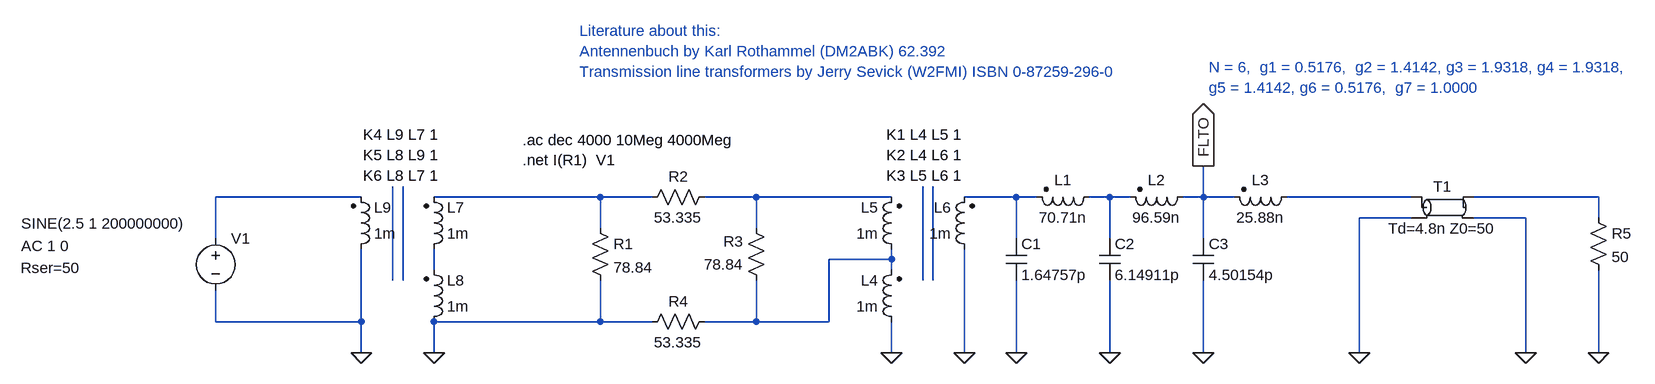
[diagram p0: schematic Circuit.asc]
Circuit.asc, the LTspice schematic file:
Version 4
SHEET 1 1860 820
WIRE -624 112 -848 112
WIRE -256 112 -512 112
WIRE -176 112 -256 112
WIRE -16 112 -96 112
WIRE 192 112 -16 112
WIRE 384 112 304 112
WIRE 416 112 384 112
WIRE 528 112 496 112
WIRE 560 112 528 112
WIRE 672 112 672 64
WIRE 672 112 640 112
WIRE 720 112 672 112
WIRE 992 112 800 112
WIRE 1280 112 1088 112
WIRE 992 144 912 144
WIRE 1168 144 1088 144
WIRE 1280 144 1280 112
WIRE -256 160 -256 112
WIRE -16 160 -16 112
WIRE -848 176 -848 112
WIRE 384 176 384 112
WIRE 528 176 528 112
WIRE 672 176 672 112
WIRE 192 208 192 192
WIRE 192 208 96 208
WIRE -512 224 -512 192
WIRE 192 224 192 208
WIRE -576 240 -576 96
WIRE -560 240 -560 96
WIRE 240 240 240 96
WIRE 256 240 256 96
WIRE -848 304 -848 256
WIRE -624 304 -624 192
WIRE -624 304 -848 304
WIRE -256 304 -256 240
WIRE -256 304 -512 304
WIRE -176 304 -256 304
WIRE -16 304 -16 240
WIRE -16 304 -96 304
WIRE 96 304 96 208
WIRE 96 304 -16 304
WIRE -624 352 -624 304
WIRE -512 352 -512 304
WIRE 192 352 192 304
WIRE 304 352 304 192
WIRE 384 352 384 240
WIRE 528 352 528 240
WIRE 672 352 672 240
WIRE 912 352 912 144
WIRE 1168 352 1168 144
WIRE 1280 352 1280 224
FLAG 192 352 0
FLAG 528 352 0
FLAG 672 352 0
FLAG 384 352 0
FLAG 304 352 0
FLAG 672 64 FLTO
IOPIN 672 64 Out
FLAG 1280 352 0
FLAG 912 352 0
FLAG 1168 352 0
FLAG -512 352 0
FLAG -624 352 0
SYMBOL res -272 144 R0
SYMATTR InstName R1
SYMATTR Value 78.84
SYMBOL res -80 96 R90
WINDOW 0 0 56 VBottom 2
WINDOW 3 32 56 VTop 2
SYMATTR InstName R2
SYMATTR Value 53.335
SYMBOL res 0 256 R180
WINDOW 0 36 76 Left 2
WINDOW 3 36 40 Left 2
SYMATTR InstName R3
SYMATTR Value 78.84
SYMBOL cap 368 176 R0
SYMATTR InstName C1
SYMATTR Value 1.64757p
SYMBOL cap 512 176 R0
SYMATTR InstName C2
SYMATTR Value 6.14911p
SYMBOL cap 656 176 R0
SYMATTR InstName C3
SYMATTR Value 4.50154p
SYMBOL ind2 512 96 R90
WINDOW 0 5 56 VBottom 2
WINDOW 3 32 56 VTop 2
SYMATTR InstName L1
SYMATTR Value 70.71n
SYMATTR Type ind
SYMBOL ind2 656 96 R90
WINDOW 0 5 56 VBottom 2
WINDOW 3 32 56 VTop 2
SYMATTR InstName L2
SYMATTR Value 96.59n
SYMATTR Type ind
SYMBOL ind2 208 208 R180
WINDOW 0 36 80 Left 2
WINDOW 3 36 40 Left 2
SYMATTR InstName L5
SYMATTR Value 1m
SYMBOL ind2 208 320 R180
WINDOW 0 36 80 Left 2
WINDOW 3 36 40 Left 2
SYMATTR InstName L4
SYMATTR Value 1m
SYMBOL ind2 320 208 R180
WINDOW 0 36 80 Left 2
WINDOW 3 36 40 Left 2
SYMATTR InstName L6
SYMATTR Value 1m
SYMBOL res -80 288 R90
WINDOW 0 0 56 VBottom 2
WINDOW 3 32 56 VTop 2
SYMATTR InstName R4
SYMATTR Value 53.335
SYMBOL res 1264 128 R0
SYMATTR InstName R5
SYMATTR Value 50
SYMBOL voltage -848 160 R0
WINDOW 123 -299 27 Left 2
WINDOW 39 -300 61 Left 2
WINDOW 3 -299 -7 Left 2
SYMATTR Value2 AC 1 0
SYMATTR SpiceLine Rser=50
SYMATTR Value SINE(2.5 1 200000000)
SYMATTR InstName V1
SYMBOL ind2 816 96 R90
WINDOW 0 5 56 VBottom 2
WINDOW 3 32 56 VTop 2
SYMATTR InstName L3
SYMATTR Value 25.88n
SYMATTR Type ind
SYMBOL tline 1040 128 R0
SYMATTR InstName T1
SYMATTR Value Td=4.8n Z0=50
SYMBOL ind2 -528 208 M180
WINDOW 0 36 80 Left 2
WINDOW 3 36 40 Left 2
SYMATTR InstName L7
SYMATTR Value 1m
SYMBOL ind2 -528 320 M180
WINDOW 0 36 80 Left 2
WINDOW 3 36 40 Left 2
SYMATTR InstName L8
SYMATTR Value 1m
SYMBOL ind2 -640 208 M180
WINDOW 0 36 80 Left 2
WINDOW 3 36 40 Left 2
SYMATTR InstName L9
SYMATTR Value 1m
TEXT -376 24 Left 2 !.ac dec 4000 10Meg 4000Meg\n.net I(R1)  V1
TEXT 184 16 Left 2 !K1 L4 L5 1\nK2 L4 L6 1\nK3 L5 L6 1
TEXT -288 -144 Left 2 ;Literature about this:\nAntennenbuch by Karl Rothammel (DM2ABK) 62.392\nTransmission line transformers by Jerry Sevick (W2FMI) ISBN 0-87259-296-0
TEXT 680 -88 Left 2 ;N = 6,  g1 = 0.5176,  g2 = 1.4142, g3 = 1.9318, g4 = 1.9318, \ng5 = 1.4142, g6 = 0.5176,  g7 = 1.0000
TEXT -504 16 Right 2 !K4 L9 L7 1\nK5 L8 L9 1\nK6 L8 L7 1

The netlist it stands for:
* Circuit.asc
R1 N002 0 78.84
R2 N003 N002 53.335
R3 N008 N003 78.84
C1 N004 0 1.64757p
C2 N005 0 6.14911p
C3 FLTO 0 4.50154p
L1 N005 N004 70.71n
L2 FLTO N005 96.59n
L5 N008 N003 1m
L4 0 N008 1m
L6 0 N004 1m
R4 N008 0 53.335
R5 N007 0 50
V1 N001 0 SINE(2.5 1 200000000) AC 1 0 Rser=50
L3 N006 FLTO 25.88n
T1 N006 0 N007 0 Td=4.8n Z0=50
L7 N009 N002 1m
L8 0 N009 1m
L9 0 N001 1m
.ac dec 4000 10Meg 4000Meg
.net I(R1)  V1
K1 L4 L5 1
K2 L4 L6 1
K3 L5 L6 1
* Literature about this:
* Antennenbuch by Karl Rothammel (DM2ABK) 62.392
* Transmission line transformers by Jerry Sevick (W2FMI) ISBN 0-87259-296-0
* N = 6,  g1 = 0.5176,  g2 = 1.4142, g3 = 1.9318, g4 = 1.9318,
* g5 = 1.4142, g6 = 0.5176,  g7 = 1.0000
K4 L9 L7 1
K5 L8 L9 1
K6 L8 L7 1
.backanno
.end